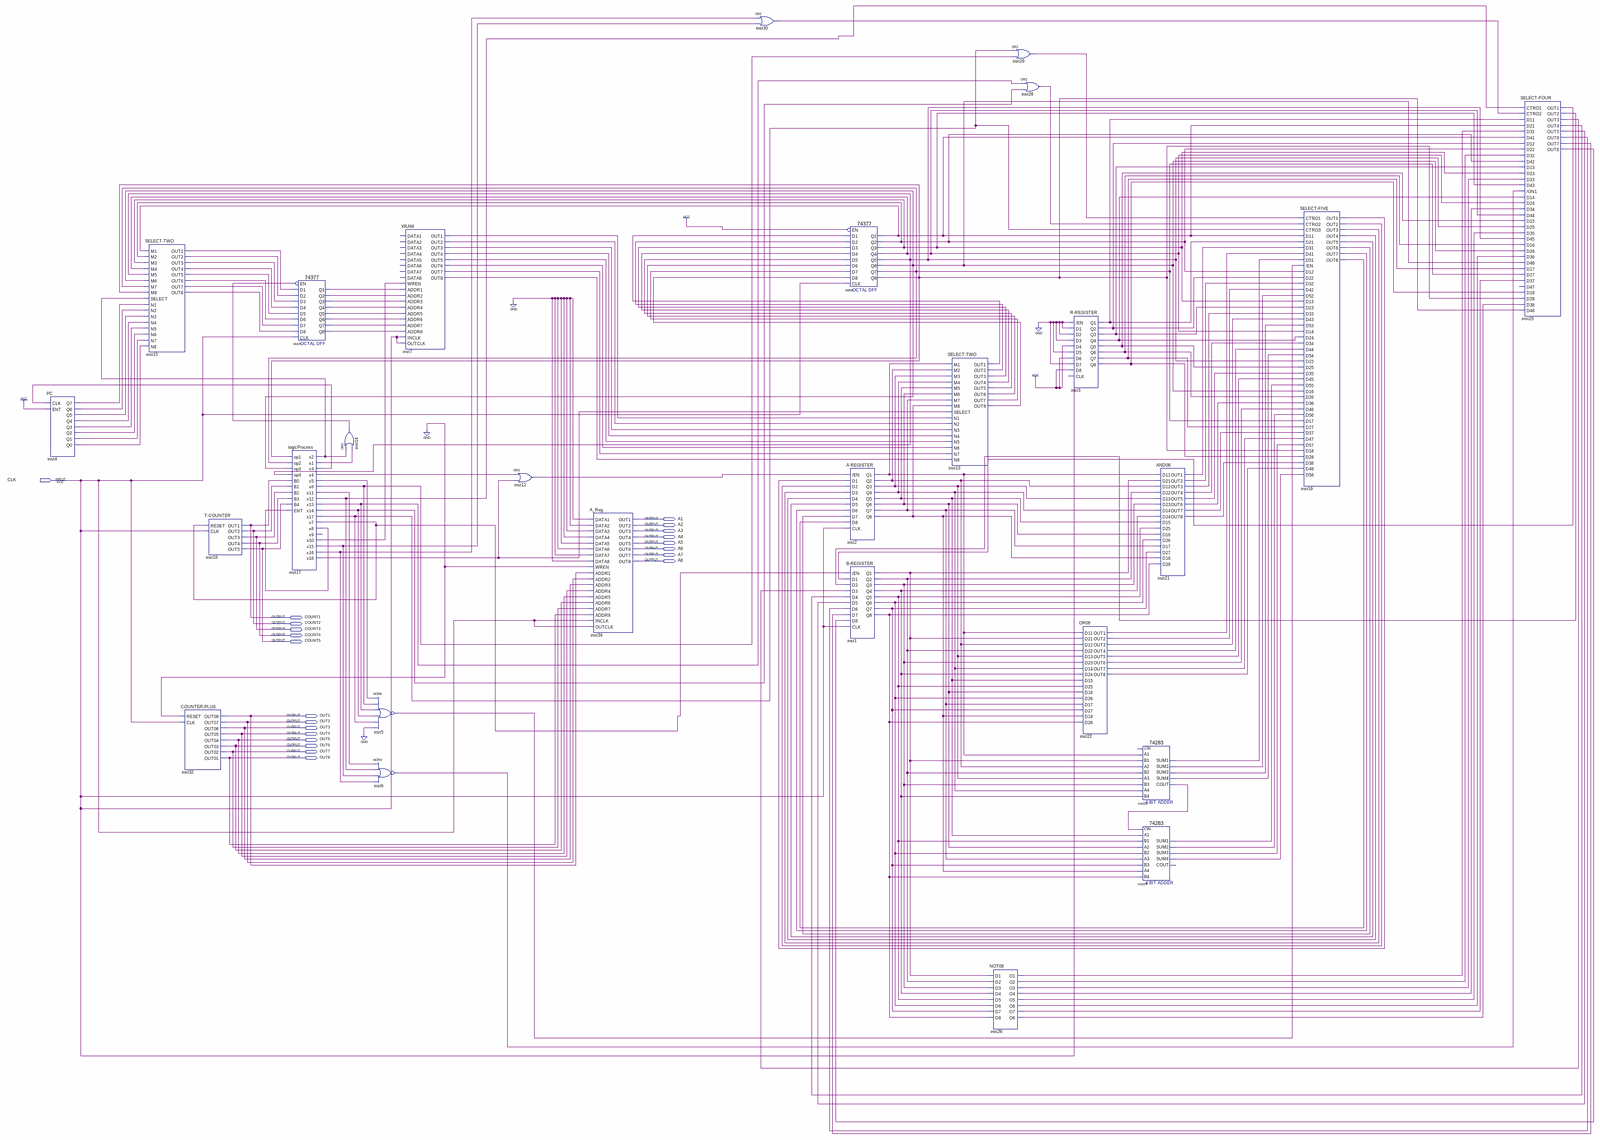
[diagram p0: schematic sheet, whole]
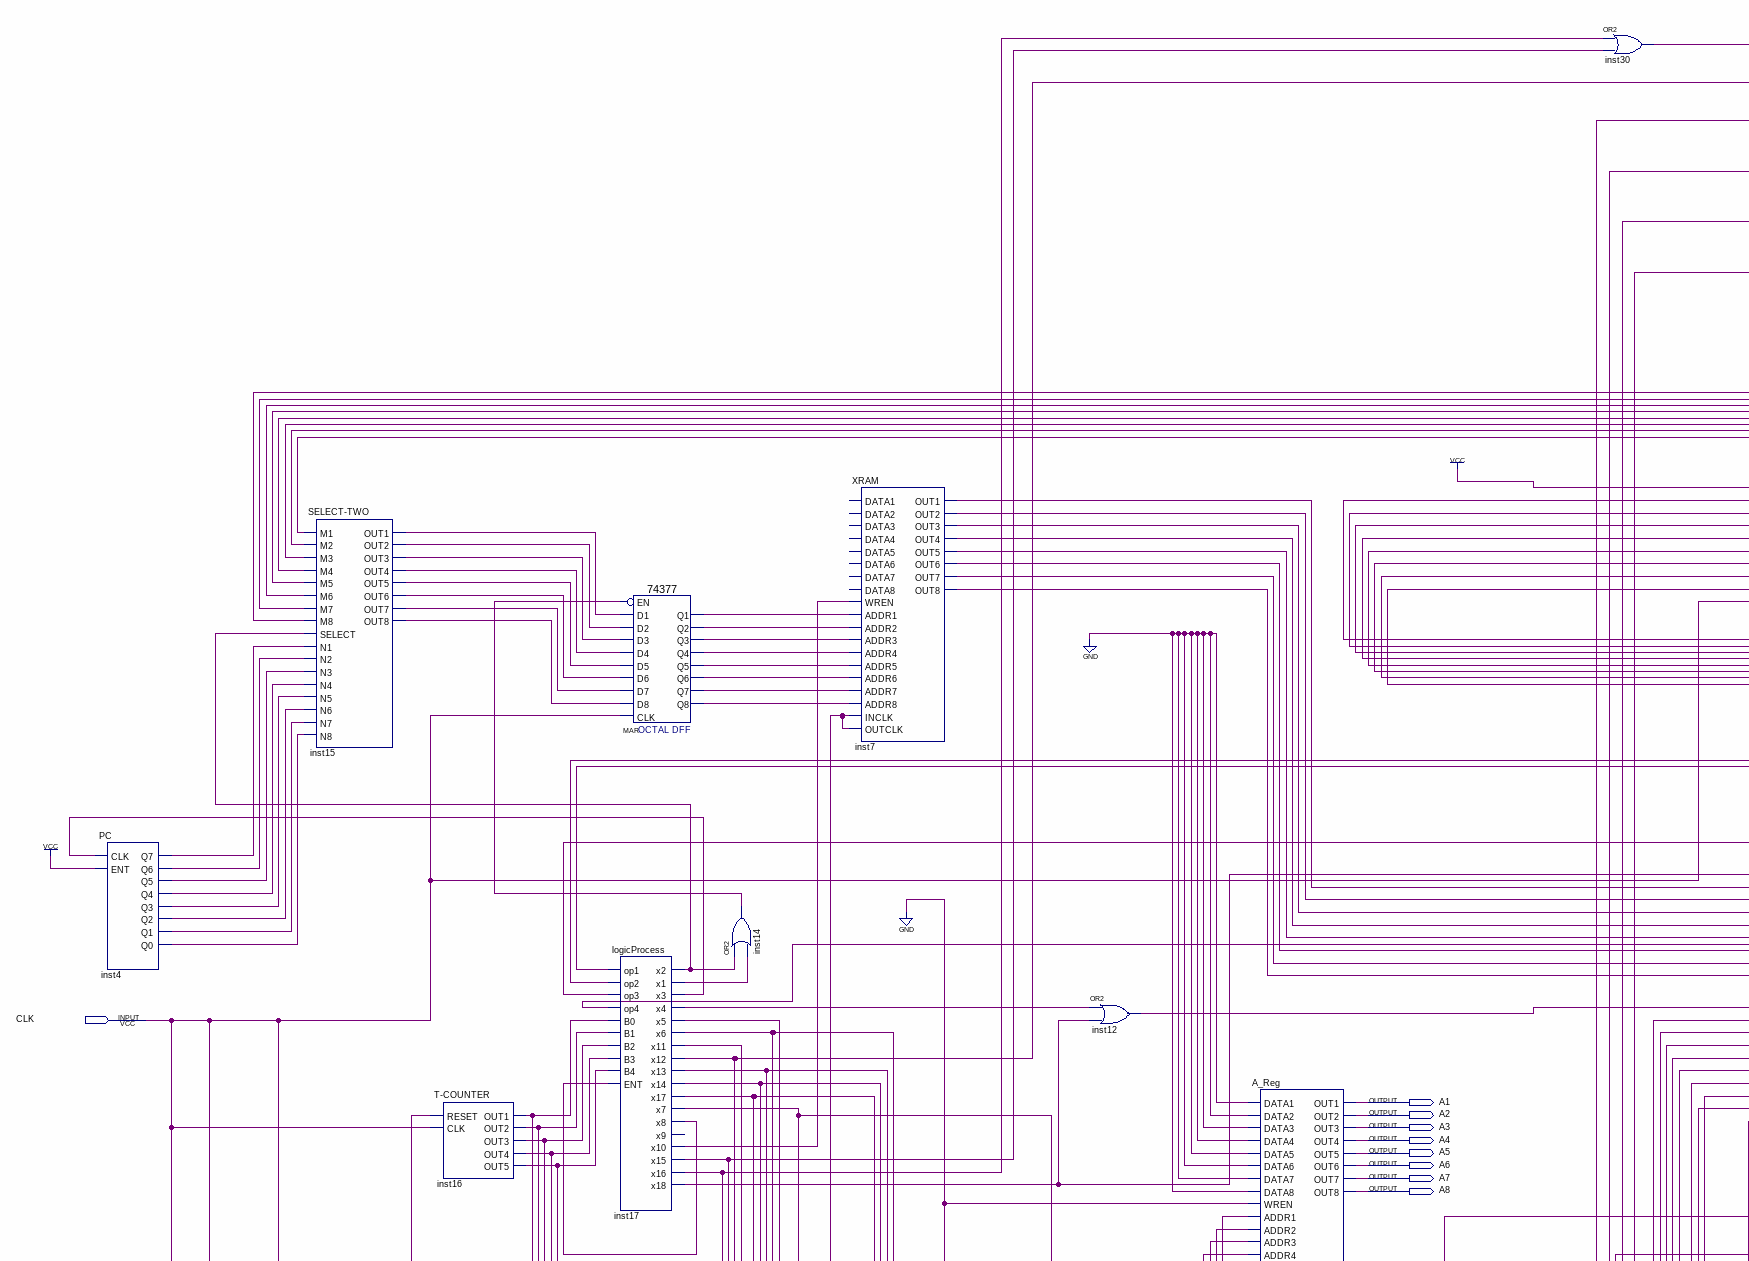
[diagram p1: schematic sheet, upper left part]
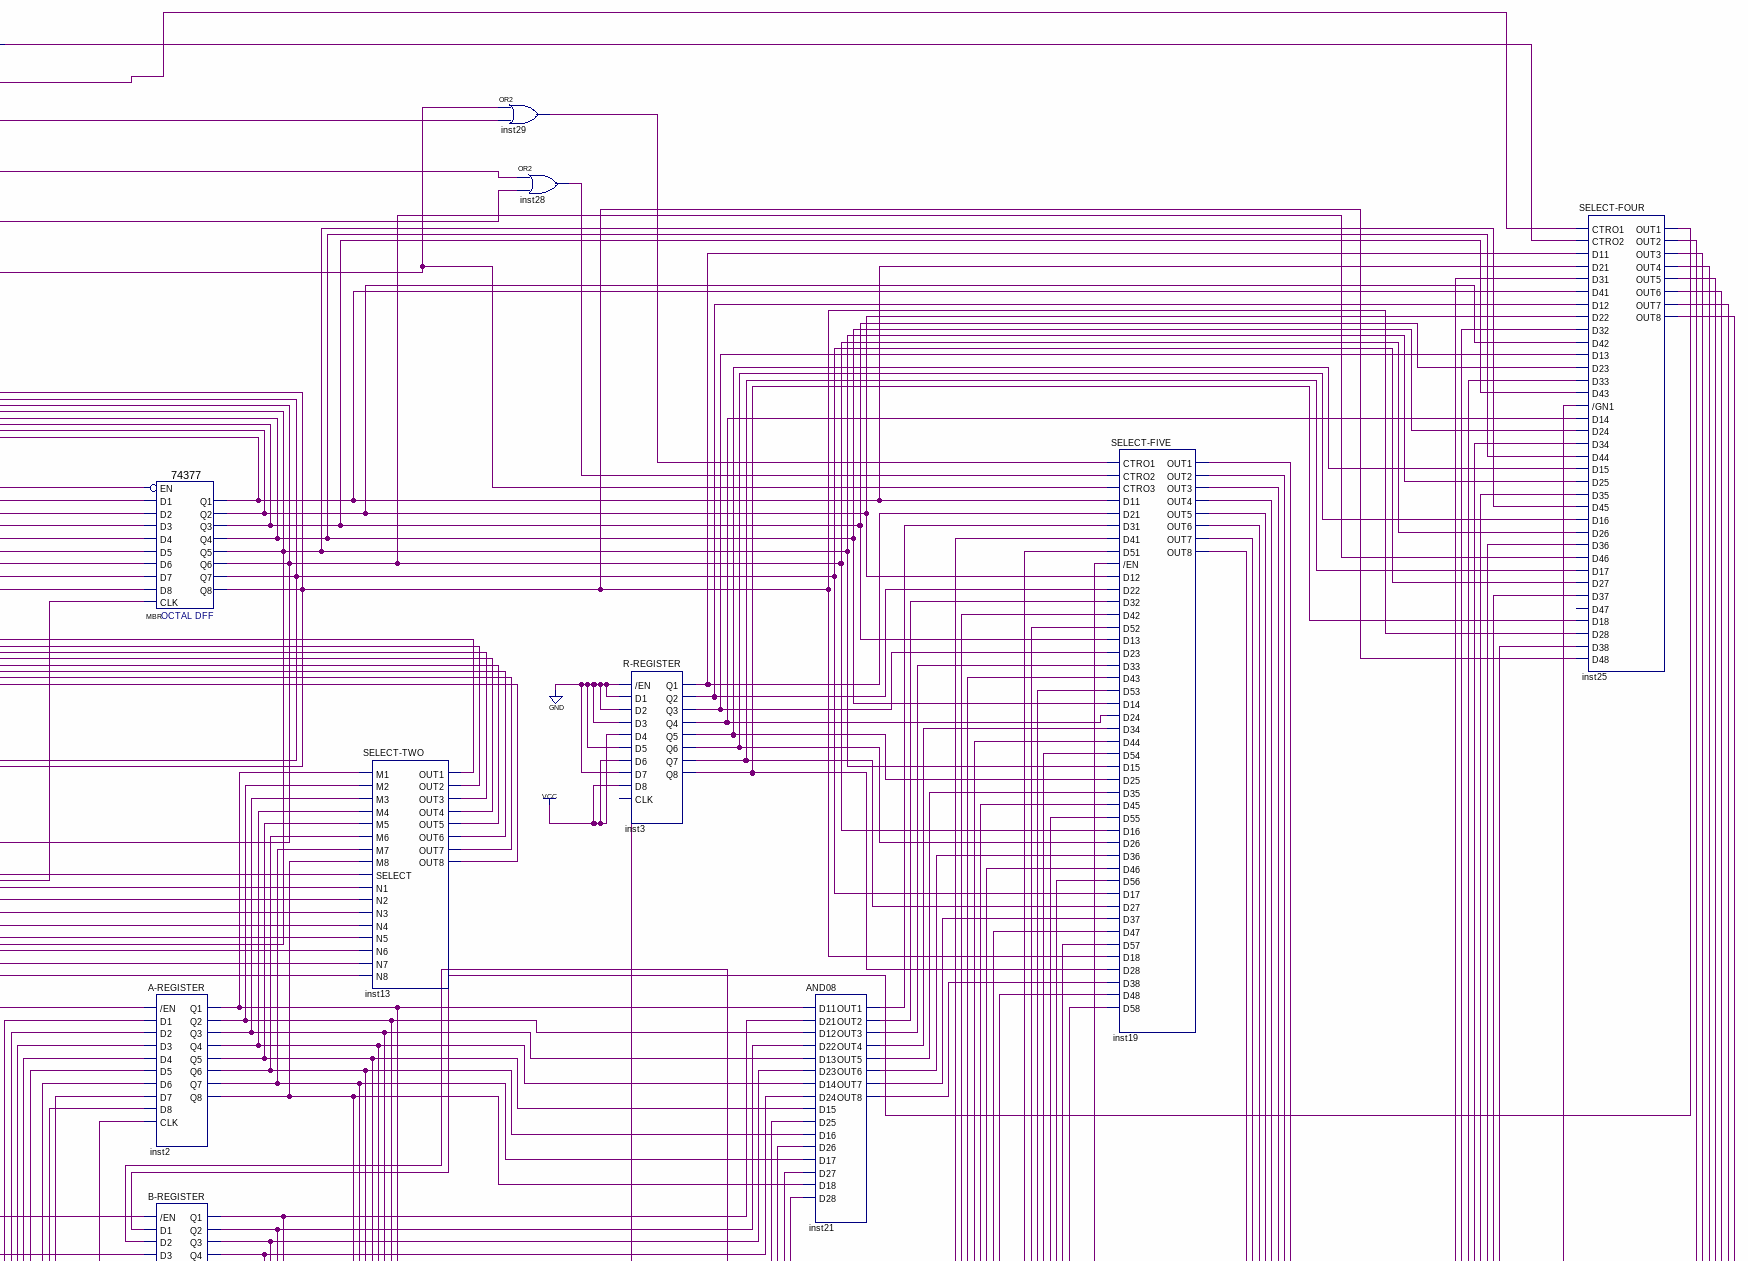
[diagram p2: schematic sheet, upper right part]
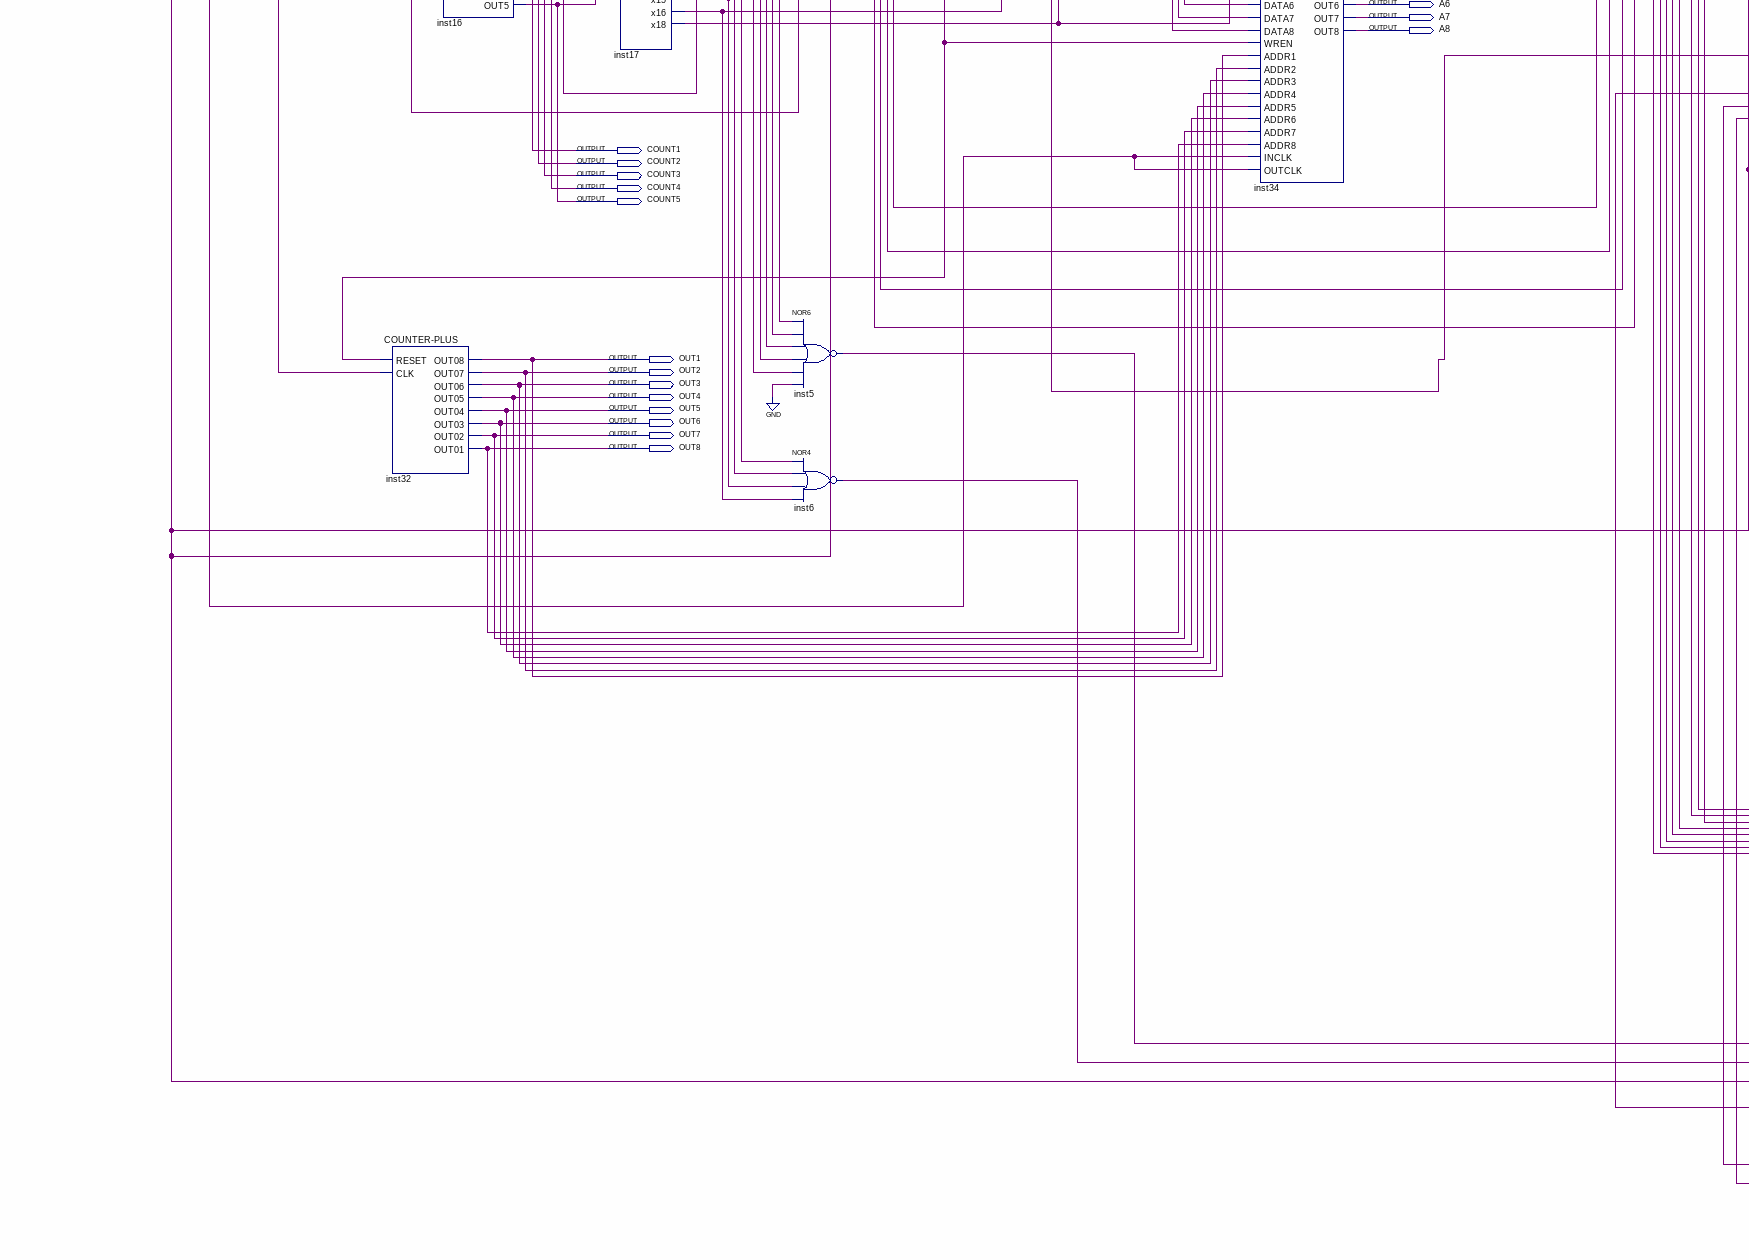
[diagram p3: schematic sheet, lower left part]
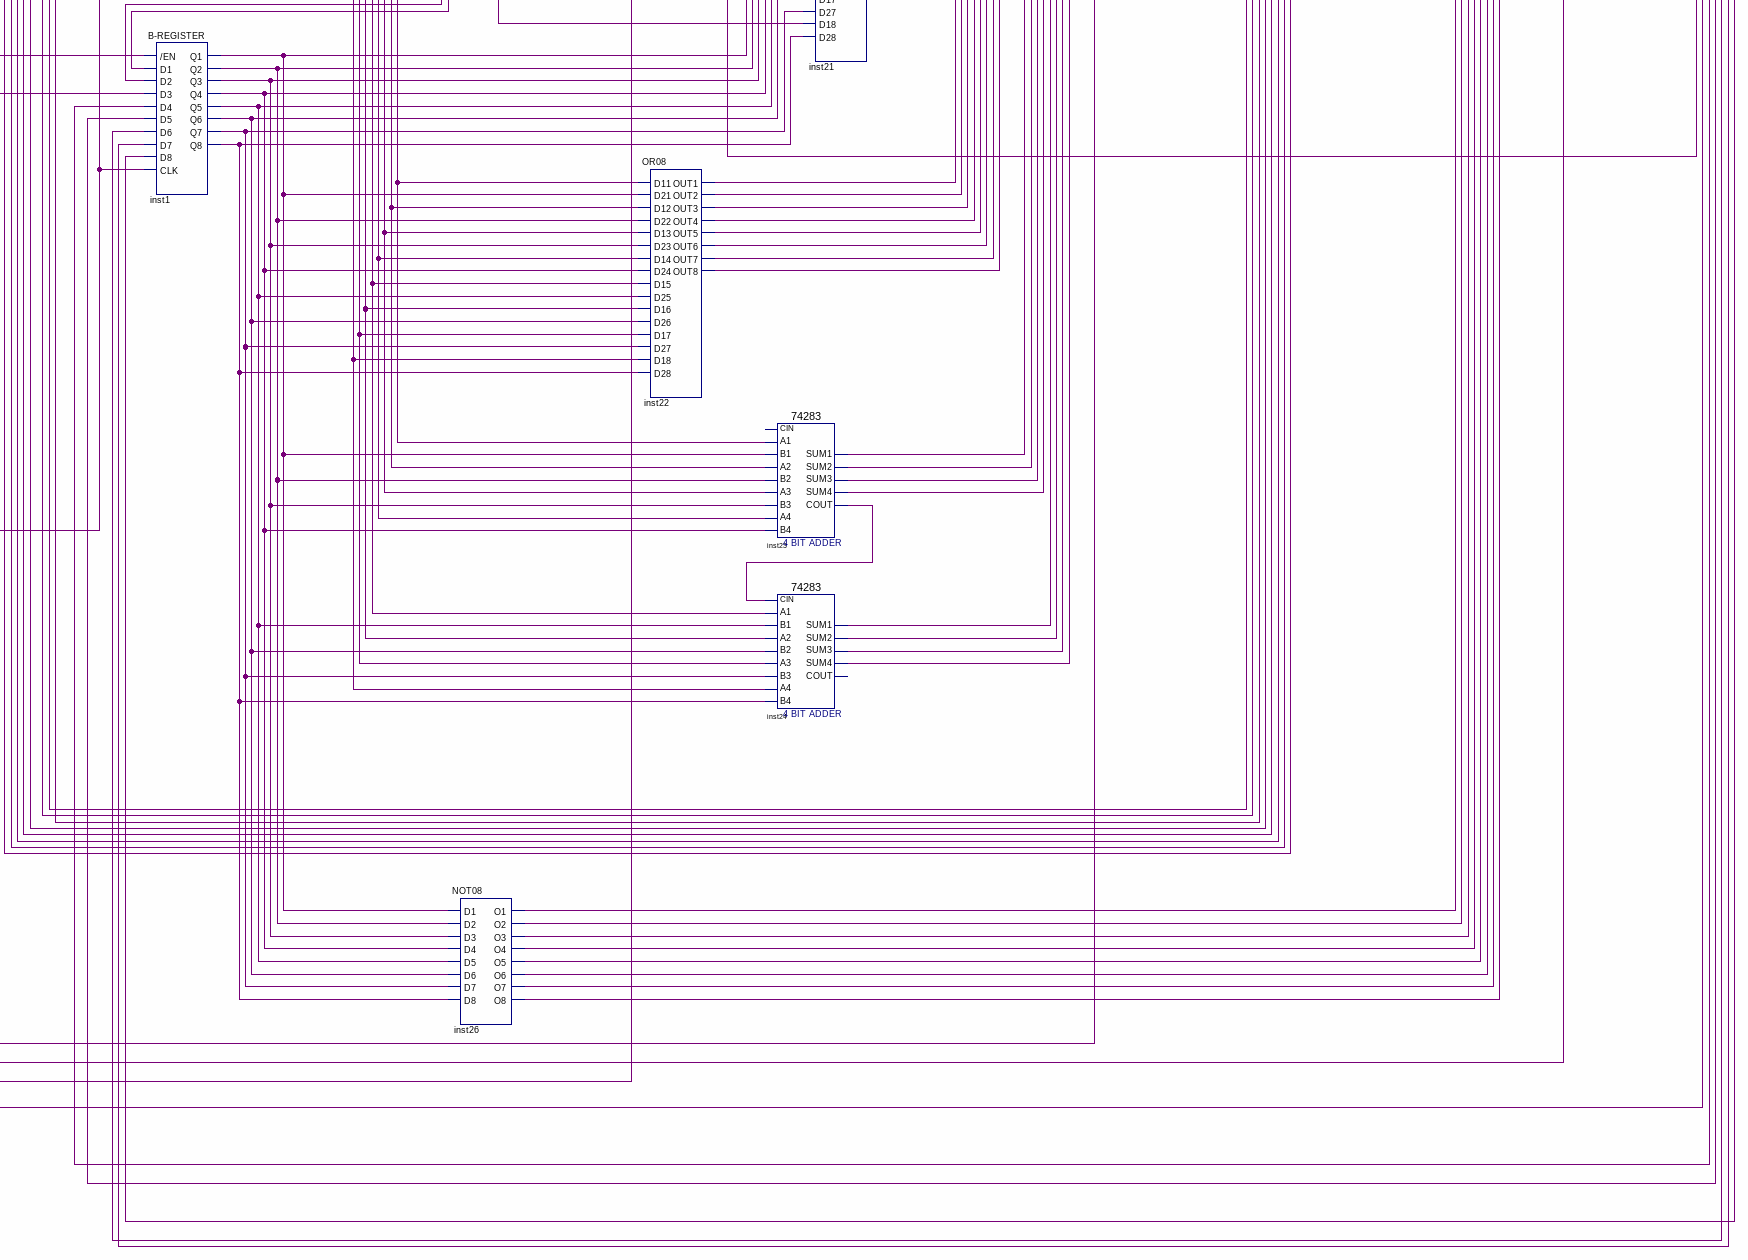
[diagram p4: schematic sheet, lower right part]
// Quartus schematic main-project.bdf as structural Verilog: 27 symbols, 22 pins
module \main-project  (
  input  CLK,
  output A1,
  output A2,
  output A3,
  output A4,
  output A5,
  output A6,
  output A7,
  output A8,
  output COUNT1,
  output COUNT2,
  output COUNT3,
  output COUNT4,
  output COUNT5,
  output OUT1,
  output OUT2,
  output OUT3,
  output OUT4,
  output OUT5,
  output OUT6,
  output OUT7,
  output OUT8
);

  wire inst1_q1, inst1_q2, inst1_q3, inst1_q4, inst1_q5, inst1_q6, inst1_q7, inst1_q8, inst2_q1, inst2_q2,
       inst2_q3, inst2_q4, inst2_q5, inst2_q6, inst2_q7, inst2_q8, inst3_q1, inst3_q2, inst3_q3, inst3_q4,
       inst3_q5, inst3_q6, inst3_q7, inst3_q8, inst4_q0, inst4_q1, inst4_q2, inst4_q3, inst4_q4, inst4_q5,
       inst4_q6, inst4_q7, inst5_out, inst6_out, inst7_out1, inst7_out2, inst7_out3, inst7_out4, inst7_out5,
       inst7_out6, inst7_out7, inst7_out8, inst12_out, inst13_out1, inst13_out2, inst13_out3, inst13_out4,
       inst13_out5, inst13_out6, inst13_out7, inst13_out8, inst14_out, inst15_out1, inst15_out2, inst15_out3,
       inst15_out4, inst15_out5, inst15_out6, inst15_out7, inst15_out8, inst17_x1, inst17_x2, inst17_x3,
       inst17_x4, inst17_x5, inst17_x6, inst17_x7, inst17_x8, inst17_x10, inst17_x11, inst17_x12, inst17_x13,
       inst17_x14, inst17_x15, inst17_x16, inst17_x17, inst17_x18, inst19_out1, inst19_out2, inst19_out3,
       inst19_out4, inst19_out5, inst19_out6, inst19_out7, inst19_out8, inst21_out1, inst21_out2,
       inst21_out3, inst21_out4, inst21_out5, inst21_out6, inst21_out7, inst21_out8, inst22_out1,
       inst22_out2, inst22_out3, inst22_out4, inst22_out5, inst22_out6, inst22_out7, inst22_out8,
       inst23_cout, inst23_sum1, inst23_sum2, inst23_sum3, inst23_sum4, inst24_sum1, inst24_sum2,
       inst24_sum3, inst24_sum4, inst25_out1, inst25_out2, inst25_out3, inst25_out4, inst25_out5,
       inst25_out6, inst25_out7, inst25_out8, inst26_o1, inst26_o2, inst26_o3, inst26_o4, inst26_o5,
       inst26_o6, inst26_o7, inst26_o8, inst28_out, inst29_out, inst30_out, MAR_q1, MAR_q2, MAR_q3, MAR_q4,
       MAR_q5, MAR_q6, MAR_q7, MAR_q8, MBR_q1, MBR_q2, MBR_q3, MBR_q4, MBR_q5, MBR_q6, MBR_q7, MBR_q8;

  PC inst4 (
    .CLK(inst17_x3), .ENT(1'b1), .Q7(inst4_q7), .Q6(inst4_q6), .Q5(inst4_q5), .Q4(inst4_q4), .Q3(inst4_q3),
    .Q2(inst4_q2), .Q1(inst4_q1), .Q0(inst4_q0));
  \SELECT-TWO  inst15 (
    .M1(MBR_q1), .M2(MBR_q2), .M3(MBR_q3), .M4(MBR_q4), .M5(MBR_q5), .M6(MBR_q6), .M7(MBR_q7), .M8(MBR_q8),
    .SELECT(inst17_x2), .N1(inst4_q7), .N2(inst4_q6), .N3(inst4_q5), .N4(inst4_q4), .N5(inst4_q3),
    .N6(inst4_q2), .N7(inst4_q1), .N8(inst4_q0), .OUT1(inst15_out1), .OUT2(inst15_out2), .OUT3(inst15_out3),
    .OUT4(inst15_out4), .OUT5(inst15_out5), .OUT6(inst15_out6), .OUT7(inst15_out7), .OUT8(inst15_out8));
  \COUNTER-PLUS  inst32 (
    .RESET(1'b0), .CLK(CLK), .OUT08(OUT1), .OUT07(OUT2), .OUT06(OUT3), .OUT05(OUT4), .OUT04(OUT5),
    .OUT03(OUT6), .OUT02(OUT7), .OUT01(OUT8));
  \T-COUNTER  inst16 (
    .RESET(inst17_x7), .CLK(CLK), .OUT1(COUNT1), .OUT2(COUNT2), .OUT3(COUNT3), .OUT4(COUNT4), .OUT5(COUNT5));
  \74377  MAR (
    .D8(inst15_out8), .D7(inst15_out7), .CLK(CLK), .D2(inst15_out2), .EN(inst14_out), .D1(inst15_out1),
    .D6(inst15_out6), .D3(inst15_out3), .D4(inst15_out4), .D5(inst15_out5), .Q8(MAR_q8), .Q7(MAR_q7),
    .Q6(MAR_q6), .Q5(MAR_q5), .Q4(MAR_q4), .Q3(MAR_q3), .Q1(MAR_q1), .Q2(MAR_q2));
  logicProcess inst17 (
    .op1(MBR_q8), .op2(MBR_q7), .op3(MBR_q6), .op4(MBR_q5), .B0(COUNT1), .B1(COUNT2), .B2(COUNT3),
    .B3(COUNT4), .B4(COUNT5), .ENT(inst17_x8), .x2(inst17_x2), .x1(inst17_x1), .x3(inst17_x3),
    .x4(inst17_x4), .x5(inst17_x5), .x6(inst17_x6), .x11(inst17_x11), .x12(inst17_x12), .x13(inst17_x13),
    .x14(inst17_x14), .x17(inst17_x17), .x7(inst17_x7), .x8(inst17_x8), .x10(inst17_x10), .x15(inst17_x15),
    .x16(inst17_x16), .x18(inst17_x18));  // open: x9
  or inst14 (inst14_out, inst17_x2, inst17_x1);
  nor inst5 (inst5_out, inst17_x5, inst17_x6, inst17_x13, inst17_x14, inst17_x17, 1'b0);
  nor inst6 (inst6_out, inst17_x11, inst17_x12, inst17_x15, inst17_x16);
  XRAM inst7 (
    .WREN(inst17_x10), .ADDR1(MAR_q1), .ADDR2(MAR_q2), .ADDR3(MAR_q3), .ADDR4(MAR_q4), .ADDR5(MAR_q5),
    .ADDR6(MAR_q6), .ADDR7(MAR_q7), .ADDR8(MAR_q8), .INCLK(CLK), .OUTCLK(CLK), .OUT1(inst7_out1),
    .OUT2(inst7_out2), .OUT3(inst7_out3), .OUT4(inst7_out4), .OUT5(inst7_out5), .OUT6(inst7_out6),
    .OUT7(inst7_out7), .OUT8(inst7_out8));  // open: DATA1, DATA2, DATA3, DATA4, DATA5, DATA6, DATA7, DATA8
  or inst12 (inst12_out, inst17_x4, inst17_x18);
  A_Reg inst34 (
    .DATA1(1'b0), .DATA2(1'b0), .DATA3(1'b0), .DATA4(1'b0), .DATA5(1'b0), .DATA6(1'b0), .DATA7(1'b0),
    .DATA8(1'b0), .WREN(1'b0), .ADDR1(OUT1), .ADDR2(OUT2), .ADDR3(OUT3), .ADDR4(OUT4), .ADDR5(OUT5),
    .ADDR6(OUT6), .ADDR7(OUT7), .ADDR8(OUT8), .INCLK(CLK), .OUTCLK(CLK), .OUT1(A1), .OUT2(A2), .OUT3(A3),
    .OUT4(A4), .OUT5(A5), .OUT6(A6), .OUT7(A7), .OUT8(A8));
  or inst30 (inst30_out, inst17_x16, inst17_x15);
  \74377  MBR (
    .D8(inst13_out8), .D7(inst13_out7), .CLK(CLK), .D2(inst13_out2), .EN(1'b1), .D1(inst13_out1),
    .D6(inst13_out6), .D3(inst13_out3), .D4(inst13_out4), .D5(inst13_out5), .Q8(MBR_q8), .Q7(MBR_q7),
    .Q6(MBR_q6), .Q5(MBR_q5), .Q4(MBR_q4), .Q3(MBR_q3), .Q1(MBR_q1), .Q2(MBR_q2));
  \A-REGISTER  inst2 (
    .\/EN (inst12_out), .D1(inst19_out1), .D2(inst19_out2), .D3(inst19_out3), .D4(inst19_out4),
    .D5(inst19_out5), .D6(inst19_out7), .D7(inst19_out6), .D8(inst19_out8), .CLK(CLK), .Q1(inst2_q1),
    .Q2(inst2_q2), .Q3(inst2_q3), .Q4(inst2_q4), .Q5(inst2_q5), .Q6(inst2_q6), .Q7(inst2_q7), .Q8(inst2_q8));
  \B-REGISTER  inst1 (
    .\/EN (inst17_x7), .D1(inst25_out1), .D2(inst25_out2), .D3(inst25_out3), .D4(inst25_out4),
    .D5(inst25_out5), .D6(inst25_out6), .D7(inst25_out7), .D8(inst25_out8), .CLK(CLK), .Q1(inst1_q1),
    .Q2(inst1_q2), .Q3(inst1_q3), .Q4(inst1_q4), .Q5(inst1_q5), .Q6(inst1_q6), .Q7(inst1_q7), .Q8(inst1_q8));
  \SELECT-TWO  inst13 (
    .M1(inst2_q1), .M2(inst2_q2), .M3(inst2_q3), .M4(inst2_q4), .M5(inst2_q5), .M6(inst2_q6), .M7(inst2_q7),
    .M8(inst2_q8), .SELECT(inst17_x18), .N1(inst7_out1), .N2(inst7_out2), .N3(inst7_out3), .N4(inst7_out4),
    .N5(inst7_out5), .N6(inst7_out6), .N7(inst7_out7), .N8(inst7_out8), .OUT1(inst13_out1),
    .OUT2(inst13_out2), .OUT3(inst13_out3), .OUT4(inst13_out4), .OUT5(inst13_out5), .OUT6(inst13_out6),
    .OUT7(inst13_out7), .OUT8(inst13_out8));
  NOT08 inst26 (
    .D1(inst1_q1), .D2(inst1_q2), .D3(inst1_q3), .D4(inst1_q4), .D5(inst1_q5), .D6(inst1_q6), .D7(inst1_q7),
    .D8(inst1_q8), .O1(inst26_o1), .O2(inst26_o2), .O3(inst26_o3), .O4(inst26_o4), .O5(inst26_o5),
    .O6(inst26_o6), .O7(inst26_o7), .O8(inst26_o8));
  or inst29 (inst29_out, inst17_x17, inst17_x6);
  or inst28 (inst28_out, inst17_x13, inst17_x14);
  \R-REGISTER  inst3 (
    .\/EN (1'b0), .D1(1'b0), .D2(1'b0), .D3(1'b0), .D4(1'b1), .D5(1'b0), .D6(1'b1), .D7(1'b0), .D8(1'b1),
    .CLK(CLK), .Q1(inst3_q1), .Q2(inst3_q2), .Q3(inst3_q3), .Q4(inst3_q4), .Q5(inst3_q5), .Q6(inst3_q6),
    .Q7(inst3_q7), .Q8(inst3_q8));
  OR08 inst22 (
    .D11(inst2_q1), .D21(inst1_q1), .D12(inst2_q2), .D22(inst1_q2), .D13(inst2_q3), .D23(inst1_q3),
    .D14(inst2_q4), .D24(inst1_q4), .D15(inst2_q5), .D25(inst1_q5), .D16(inst2_q6), .D26(inst1_q6),
    .D17(inst2_q7), .D27(inst1_q7), .D18(inst2_q8), .D28(inst1_q8), .OUT1(inst22_out1), .OUT2(inst22_out2),
    .OUT3(inst22_out3), .OUT4(inst22_out4), .OUT5(inst22_out5), .OUT6(inst22_out6), .OUT7(inst22_out7),
    .OUT8(inst22_out8));
  \74283  inst23 (
    .A1(inst2_q1), .A2(inst2_q2), .B2(inst1_q2), .A3(inst2_q3), .A4(inst2_q4), .B4(inst1_q4), .B1(inst1_q1),
    .B3(inst1_q3), .SUM4(inst23_sum4), .COUT(inst23_cout), .SUM1(inst23_sum1), .SUM2(inst23_sum2),
    .SUM3(inst23_sum3));  // open: CIN
  \74283  inst24 (
    .CIN(inst23_cout), .A1(inst2_q5), .A2(inst2_q6), .B2(inst1_q6), .A3(inst2_q7), .A4(inst2_q8),
    .B4(inst1_q8), .B1(inst1_q5), .B3(inst1_q7), .SUM4(inst24_sum4), .SUM1(inst24_sum1), .SUM2(inst24_sum2),
    .SUM3(inst24_sum3));  // open: COUT
  AND08 inst21 (
    .D11(inst2_q1), .D21(inst1_q1), .D12(inst2_q2), .D22(inst1_q2), .D13(inst2_q3), .D23(inst1_q3),
    .D14(inst2_q4), .D24(inst1_q4), .D15(inst2_q5), .D25(inst1_q5), .D16(inst2_q6), .D26(inst1_q6),
    .D17(inst2_q7), .D27(inst1_q7), .D18(inst2_q8), .D28(inst1_q8), .OUT1(inst21_out1), .OUT2(inst21_out2),
    .OUT3(inst21_out3), .OUT4(inst21_out4), .OUT5(inst21_out5), .OUT6(inst21_out6), .OUT7(inst21_out7),
    .OUT8(inst21_out8));
  \SELECT-FIVE  inst19 (
    .CTRO1(inst29_out), .CTRO2(inst28_out), .CTRO3(inst17_x17), .D11(MBR_q1), .D21(inst3_q1),
    .D31(inst21_out1), .D41(inst22_out1), .D51(inst23_sum1), .\/EN (inst5_out), .D12(MBR_q2), .D22(inst3_q2),
    .D32(inst21_out2), .D42(inst22_out2), .D52(inst23_sum2), .D13(MBR_q3), .D23(inst3_q3), .D33(inst21_out3),
    .D43(inst22_out3), .D53(inst23_sum3), .D14(MBR_q4), .D24(inst3_q4), .D34(inst21_out4), .D44(inst22_out4),
    .D54(inst23_sum4), .D15(MBR_q5), .D25(inst3_q5), .D35(inst21_out5), .D45(inst22_out5), .D55(inst24_sum1),
    .D16(MBR_q6), .D26(inst3_q6), .D36(inst21_out6), .D46(inst22_out6), .D56(inst24_sum2), .D17(MBR_q7),
    .D27(inst3_q7), .D37(inst21_out7), .D47(inst22_out7), .D57(inst24_sum3), .D18(MBR_q8), .D28(inst3_q8),
    .D38(inst21_out8), .D48(inst22_out8), .D58(inst24_sum4), .OUT1(inst19_out1), .OUT2(inst19_out2),
    .OUT3(inst19_out3), .OUT4(inst19_out4), .OUT5(inst19_out5), .OUT6(inst19_out6), .OUT7(inst19_out7),
    .OUT8(inst19_out8));
  \SELECT-FOUR  inst25 (
    .CTRO1(inst17_x12), .CTRO2(inst30_out), .D11(inst3_q1), .D21(MBR_q1), .D31(inst26_o1), .D41(MBR_q1),
    .D12(inst3_q2), .D22(MBR_q2), .D32(inst26_o2), .D42(MBR_q2), .D13(inst3_q3), .D23(MBR_q3),
    .D33(inst26_o3), .D43(MBR_q3), .\/GN1 (inst6_out), .D14(inst3_q4), .D24(MBR_q4), .D34(inst26_o4),
    .D44(MBR_q4), .D15(inst3_q5), .D25(MBR_q5), .D35(inst26_o5), .D45(MBR_q5), .D16(inst3_q6), .D26(MBR_q6),
    .D36(inst26_o6), .D46(MBR_q6), .D17(inst3_q7), .D27(MBR_q7), .D37(inst26_o7), .D18(inst3_q8),
    .D28(MBR_q8), .D38(inst26_o8), .D48(MBR_q8), .OUT1(inst25_out1), .OUT2(inst25_out2), .OUT3(inst25_out3),
    .OUT4(inst25_out4), .OUT5(inst25_out5), .OUT6(inst25_out6), .OUT7(inst25_out7), .OUT8(inst25_out8));  // open: D47
endmodule
